# Altium schematic sheet Connectors and Headers.SchDoc
size A
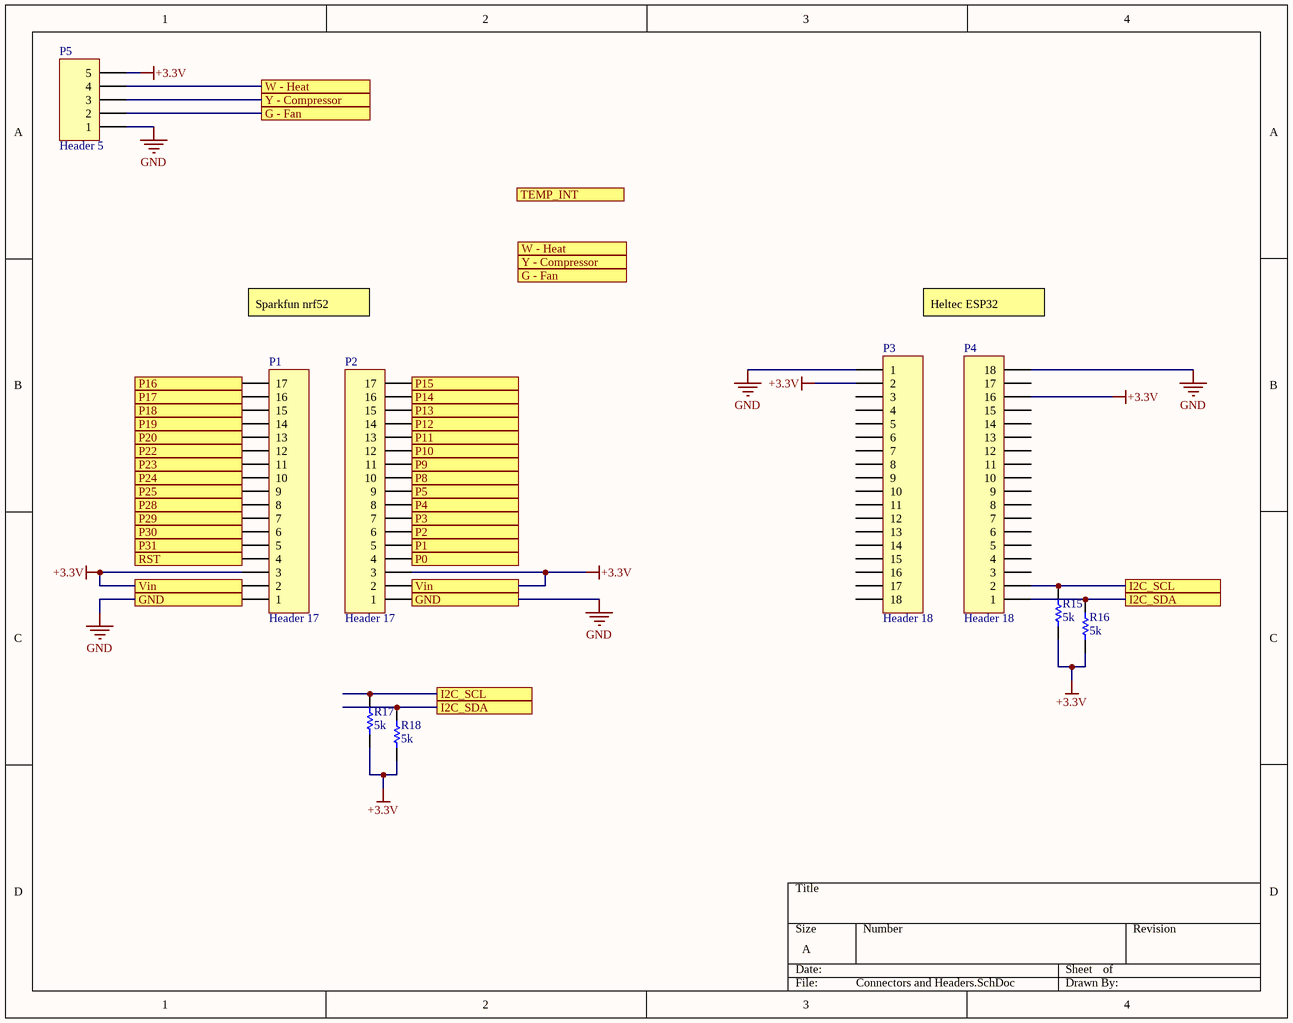
[diagram p0: Connectors and Headers.SchDoc]

## Parts
P1  Header 17  [HDR1X17]
P2  Header 17  [HDR1X17]
P3  Header 18  [HDR1X18]
P4  Header 18  [HDR1X18]
P5  Header 5  [HDR1X5]
R15  5k  [RESC2013X70X40LL20T20]
R16  5k  [RESC2013X70X40LL20T20]
R17  5k  [RESC2013X70X40LL20T20]
R18  5k  [RESC2013X70X40LL20T20]

## Ports
G - Fan, GND, I2C_SCL, I2C_SDA, P0, P1, P2, P3, P4, P5, P8, P9, P10, P11, P12, P13, P14, P15, P16, P17, P18, P19, P20, P22, P23, P24, P25, P28, P29, P30, P31, RST, TEMP_INT, Vin, W - Heat, Y - Compressor

## Nets
+3.3V: P1.2 P1.3 P2.2 P2.3 P3.2 P4.16 P5.5 R15.1 R16.1 R17.1 R18.1 ; port Vin
GND: P1.1 P2.1 P3.1 P4.18 P5.1 ; port GND
G - Fan: P5.2 ; port G - Fan
I2C_SCL: P4.2 R15.2 R17.2 ; port I2C_SCL
I2C_SDA: P4.1 R16.2 R18.2 ; port I2C_SDA
P0: P2.4 ; port P0
P1: P2.5 ; port P1
P2: P2.6 ; port P2
P3: P2.7 ; port P3
P4: P2.8 ; port P4
P5: P2.9 ; port P5
P8: P2.10 ; port P8
P9: P2.11 ; port P9
P10: P2.12 ; port P10
P11: P2.13 ; port P11
P12: P2.14 ; port P12
P13: P2.15 ; port P13
P14: P2.16 ; port P14
P15: P2.17 ; port P15
P16: P1.17 ; port P16
P17: P1.16 ; port P17
P18: P1.15 ; port P18
P19: P1.14 ; port P19
P20: P1.13 ; port P20
P22: P1.12 ; port P22
P23: P1.11 ; port P23
P24: P1.10 ; port P24
P25: P1.9 ; port P25
P28: P1.8 ; port P28
P29: P1.7 ; port P29
P30: P1.6 ; port P30
P31: P1.5 ; port P31
RST: P1.4 ; port RST
W - Heat: P5.4 ; port W - Heat
Y - Compressor: P5.3 ; port Y - Compressor

Not connected (* = marked no-connect by the designer): P3 3 4 5 6 7 8 9 10 11 12 13 14 15 16 17 18; P4 3 4 5 6 7 8 9 10 11 12 13 14 15 17

## Notes on the sheet
- Sparkfun nrf52
- Heltec ESP32

## Library data of the parts
P1 P2 = Header 17: Header, 17-Pin; LatestRevisionDate: 17-Jul-2002; LatestRevisionNote: Re-released for DXP Platform.; Publisher: Altium Limited
P3 P4 = Header 18: Header, 18-Pin; LatestRevisionDate: 17-Jul-2002; LatestRevisionNote: Re-released for DXP Platform.; Publisher: Altium Limited
P5 = Header 5: Header, 5-Pin; LatestRevisionDate: 17-Jul-2002; LatestRevisionNote: Re-released for DXP Platform.; Publisher: Altium Limited
R15-R18 = CMP-2001-00419-1: 2012; Part Number: ERJ-6GEYJ471V; Manufacturer: Panasonic